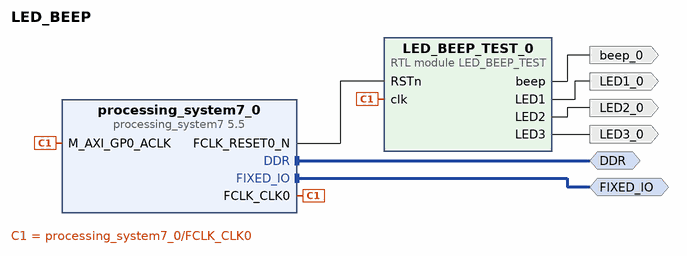
[diagram p0: block diagram of the top level]
# Vivado block design LED_BEEP, xc7z010clg400-1, Vivado 2018.3
create_bd_design LED_BEEP

create_bd_intf_port -mode Master -vlnv xilinx.com:interface:ddrx_rtl:1.0 DDR
create_bd_intf_port -mode Master -vlnv xilinx.com:display_processing_system7:fixedio_rtl:1.0 FIXED_IO
create_bd_port -dir O LED1_0
create_bd_port -dir O LED2_0
create_bd_port -dir O LED3_0
create_bd_port -dir O beep_0

create_bd_cell -type ip -vlnv xilinx.com:ip:processing_system7:5.5 processing_system7_0
set_property -dict [list \
  CONFIG.PCW_UIPARAM_DDR_BUS_WIDTH {16 Bit} \
  CONFIG.PCW_UIPARAM_DDR_PARTNO {MT41K128M16 JT-125} \
] [get_bd_cells processing_system7_0]
# 3 more settings of processing_system7_0 are not shown: defaults, MIO pin electricals, DDR timing, and values the tool derives
create_bd_cell -type module -reference LED_BEEP_TEST LED_BEEP_TEST_0

# ---- connections ----

connect_bd_intf_net [get_bd_intf_ports FIXED_IO] [get_bd_intf_pins processing_system7_0/FIXED_IO]
connect_bd_intf_net [get_bd_intf_ports DDR] [get_bd_intf_pins processing_system7_0/DDR]
connect_bd_net [get_bd_pins processing_system7_0/FCLK_CLK0] [get_bd_pins processing_system7_0/M_AXI_GP0_ACLK] [get_bd_pins LED_BEEP_TEST_0/clk]
connect_bd_net [get_bd_pins processing_system7_0/FCLK_RESET0_N] [get_bd_pins LED_BEEP_TEST_0/RSTn]
connect_bd_net [get_bd_pins LED_BEEP_TEST_0/LED1] [get_bd_ports LED1_0]
connect_bd_net [get_bd_pins LED_BEEP_TEST_0/LED2] [get_bd_ports LED2_0]
connect_bd_net [get_bd_pins LED_BEEP_TEST_0/LED3] [get_bd_ports LED3_0]
connect_bd_net [get_bd_pins LED_BEEP_TEST_0/beep] [get_bd_ports beep_0]

validate_bd_design
save_bd_design
